# EAGLE design 35x35 (EAGLE 6.4)
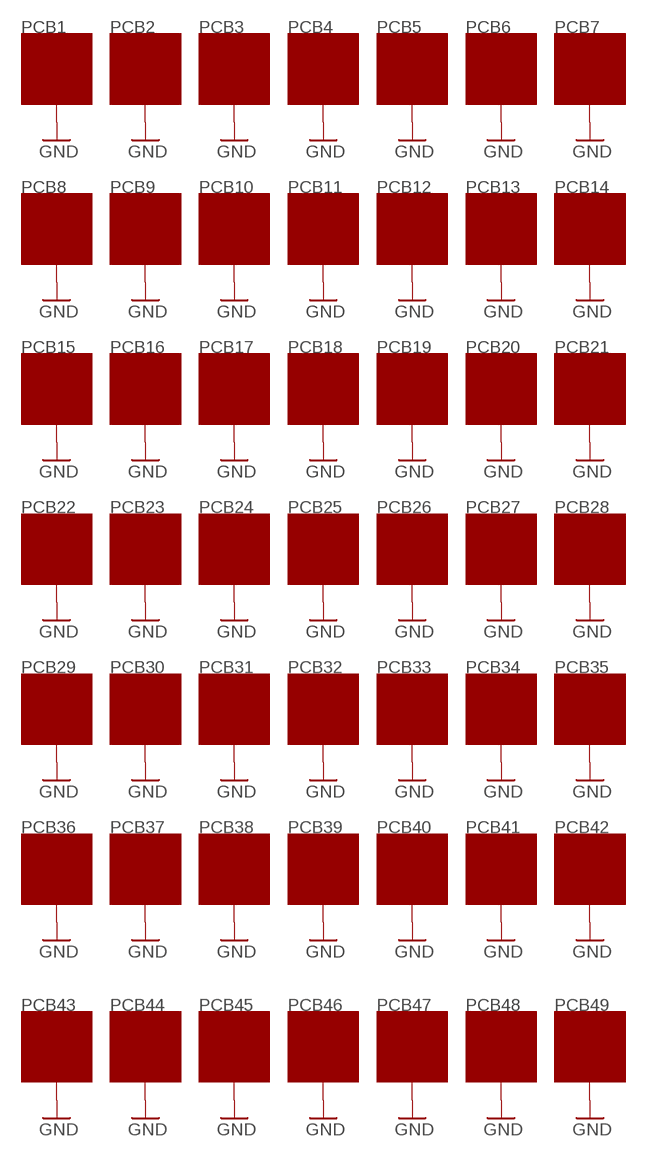
[diagram p0: schematic, sheet 1]

## Parts
PCB1  ZZZ_MODULE05X05  [ZZZ_MODULE_05X05]
PCB2  ZZZ_MODULE05X05  [ZZZ_MODULE_05X05]
PCB3  ZZZ_MODULE05X05  [ZZZ_MODULE_05X05]
PCB4  ZZZ_MODULE05X05  [ZZZ_MODULE_05X05]
PCB5  ZZZ_MODULE05X05  [ZZZ_MODULE_05X05]
PCB6  ZZZ_MODULE05X05  [ZZZ_MODULE_05X05]
PCB7  ZZZ_MODULE05X05  [ZZZ_MODULE_05X05]
PCB8  ZZZ_MODULE05X05  [ZZZ_MODULE_05X05]
PCB9  ZZZ_MODULE05X05  [ZZZ_MODULE_05X05]
PCB10  ZZZ_MODULE05X05  [ZZZ_MODULE_05X05]
PCB11  ZZZ_MODULE05X05  [ZZZ_MODULE_05X05]
PCB12  ZZZ_MODULE05X05  [ZZZ_MODULE_05X05]
PCB13  ZZZ_MODULE05X05  [ZZZ_MODULE_05X05]
PCB14  ZZZ_MODULE05X05  [ZZZ_MODULE_05X05]
PCB15  ZZZ_MODULE05X05  [ZZZ_MODULE_05X05]
PCB16  ZZZ_MODULE05X05  [ZZZ_MODULE_05X05]
PCB17  ZZZ_MODULE05X05  [ZZZ_MODULE_05X05]
PCB18  ZZZ_MODULE05X05  [ZZZ_MODULE_05X05]
PCB19  ZZZ_MODULE05X05  [ZZZ_MODULE_05X05]
PCB20  ZZZ_MODULE05X05  [ZZZ_MODULE_05X05]
PCB21  ZZZ_MODULE05X05  [ZZZ_MODULE_05X05]
PCB22  ZZZ_MODULE05X05  [ZZZ_MODULE_05X05]
PCB23  ZZZ_MODULE05X05  [ZZZ_MODULE_05X05]
PCB24  ZZZ_MODULE05X05  [ZZZ_MODULE_05X05]
PCB25  ZZZ_MODULE05X05  [ZZZ_MODULE_05X05]
PCB26  ZZZ_MODULE05X05  [ZZZ_MODULE_05X05]
PCB27  ZZZ_MODULE05X05  [ZZZ_MODULE_05X05]
PCB28  ZZZ_MODULE05X05  [ZZZ_MODULE_05X05]
PCB29  ZZZ_MODULE05X05  [ZZZ_MODULE_05X05]
PCB30  ZZZ_MODULE05X05  [ZZZ_MODULE_05X05]
PCB31  ZZZ_MODULE05X05  [ZZZ_MODULE_05X05]
PCB32  ZZZ_MODULE05X05  [ZZZ_MODULE_05X05]
PCB33  ZZZ_MODULE05X05  [ZZZ_MODULE_05X05]
PCB34  ZZZ_MODULE05X05  [ZZZ_MODULE_05X05]
PCB35  ZZZ_MODULE05X05  [ZZZ_MODULE_05X05]
PCB36  ZZZ_MODULE05X05  [ZZZ_MODULE_05X05]
PCB37  ZZZ_MODULE05X05  [ZZZ_MODULE_05X05]
PCB38  ZZZ_MODULE05X05  [ZZZ_MODULE_05X05]
PCB39  ZZZ_MODULE05X05  [ZZZ_MODULE_05X05]
PCB40  ZZZ_MODULE05X05  [ZZZ_MODULE_05X05]
PCB41  ZZZ_MODULE05X05  [ZZZ_MODULE_05X05]
PCB42  ZZZ_MODULE05X05  [ZZZ_MODULE_05X05]
PCB43  ZZZ_MODULE05X05  [ZZZ_MODULE_05X05]
PCB44  ZZZ_MODULE05X05  [ZZZ_MODULE_05X05]
PCB45  ZZZ_MODULE05X05  [ZZZ_MODULE_05X05]
PCB46  ZZZ_MODULE05X05  [ZZZ_MODULE_05X05]
PCB47  ZZZ_MODULE05X05  [ZZZ_MODULE_05X05]
PCB48  ZZZ_MODULE05X05  [ZZZ_MODULE_05X05]
PCB49  ZZZ_MODULE05X05  [ZZZ_MODULE_05X05]

## Nets
GND: PCB1.GND@1(GND) PCB1.GND@2(GND) PCB1.GND@3(GND) PCB1.GND@4(GND) PCB1.GND@5(GND) PCB1.GND@6(GND) PCB1.GND@7(GND) PCB1.GND@8(GND) PCB2.GND@1(GND) PCB2.GND@2(GND) PCB2.GND@3(GND) PCB2.GND@4(GND) PCB2.GND@5(GND) PCB2.GND@6(GND) PCB2.GND@7(GND) PCB2.GND@8(GND) PCB3.GND@1(GND) PCB3.GND@2(GND) PCB3.GND@3(GND) PCB3.GND@4(GND) PCB3.GND@5(GND) PCB3.GND@6(GND) PCB3.GND@7(GND) PCB3.GND@8(GND) PCB4.GND@1(GND) PCB4.GND@2(GND) PCB4.GND@3(GND) PCB4.GND@4(GND) PCB4.GND@5(GND) PCB4.GND@6(GND) PCB4.GND@7(GND) PCB4.GND@8(GND) PCB5.GND@1(GND) PCB5.GND@2(GND) PCB5.GND@3(GND) PCB5.GND@4(GND) PCB5.GND@5(GND) PCB5.GND@6(GND) PCB5.GND@7(GND) PCB5.GND@8(GND) PCB6.GND@1(GND) PCB6.GND@2(GND) PCB6.GND@3(GND) PCB6.GND@4(GND) PCB6.GND@5(GND) PCB6.GND@6(GND) PCB6.GND@7(GND) PCB6.GND@8(GND) PCB7.GND@1(GND) PCB7.GND@2(GND) PCB7.GND@3(GND) PCB7.GND@4(GND) PCB7.GND@5(GND) PCB7.GND@6(GND) PCB7.GND@7(GND) PCB7.GND@8(GND) PCB8.GND@1(GND) PCB8.GND@2(GND) PCB8.GND@3(GND) PCB8.GND@4(GND) PCB8.GND@5(GND) PCB8.GND@6(GND) PCB8.GND@7(GND) PCB8.GND@8(GND) PCB9.GND@1(GND) PCB9.GND@2(GND) PCB9.GND@3(GND) PCB9.GND@4(GND) PCB9.GND@5(GND) PCB9.GND@6(GND) PCB9.GND@7(GND) PCB9.GND@8(GND) PCB10.GND@1(GND) PCB10.GND@2(GND) PCB10.GND@3(GND) PCB10.GND@4(GND) PCB10.GND@5(GND) PCB10.GND@6(GND) PCB10.GND@7(GND) PCB10.GND@8(GND) PCB11.GND@1(GND) PCB11.GND@2(GND) PCB11.GND@3(GND) PCB11.GND@4(GND) PCB11.GND@5(GND) PCB11.GND@6(GND) PCB11.GND@7(GND) PCB11.GND@8(GND) PCB12.GND@1(GND) PCB12.GND@2(GND) PCB12.GND@3(GND) PCB12.GND@4(GND) PCB12.GND@5(GND) PCB12.GND@6(GND) PCB12.GND@7(GND) PCB12.GND@8(GND) PCB13.GND@1(GND) PCB13.GND@2(GND) PCB13.GND@3(GND) PCB13.GND@4(GND) PCB13.GND@5(GND) PCB13.GND@6(GND) PCB13.GND@7(GND) PCB13.GND@8(GND) PCB14.GND@1(GND) PCB14.GND@2(GND) PCB14.GND@3(GND) PCB14.GND@4(GND) PCB14.GND@5(GND) PCB14.GND@6(GND) PCB14.GND@7(GND) PCB14.GND@8(GND) PCB15.GND@1(GND) PCB15.GND@2(GND) PCB15.GND@3(GND) PCB15.GND@4(GND) PCB15.GND@5(GND) PCB15.GND@6(GND) PCB15.GND@7(GND) PCB15.GND@8(GND) PCB16.GND@1(GND) PCB16.GND@2(GND) PCB16.GND@3(GND) PCB16.GND@4(GND) PCB16.GND@5(GND) PCB16.GND@6(GND) PCB16.GND@7(GND) PCB16.GND@8(GND) PCB17.GND@1(GND) PCB17.GND@2(GND) PCB17.GND@3(GND) PCB17.GND@4(GND) PCB17.GND@5(GND) PCB17.GND@6(GND) PCB17.GND@7(GND) PCB17.GND@8(GND) PCB18.GND@1(GND) PCB18.GND@2(GND) PCB18.GND@3(GND) PCB18.GND@4(GND) PCB18.GND@5(GND) PCB18.GND@6(GND) PCB18.GND@7(GND) PCB18.GND@8(GND) PCB19.GND@1(GND) PCB19.GND@2(GND) PCB19.GND@3(GND) PCB19.GND@4(GND) PCB19.GND@5(GND) PCB19.GND@6(GND) PCB19.GND@7(GND) PCB19.GND@8(GND) PCB20.GND@1(GND) PCB20.GND@2(GND) PCB20.GND@3(GND) PCB20.GND@4(GND) PCB20.GND@5(GND) PCB20.GND@6(GND) PCB20.GND@7(GND) PCB20.GND@8(GND) PCB21.GND@1(GND) PCB21.GND@2(GND) PCB21.GND@3(GND) PCB21.GND@4(GND) PCB21.GND@5(GND) PCB21.GND@6(GND) PCB21.GND@7(GND) PCB21.GND@8(GND) PCB22.GND@1(GND) PCB22.GND@2(GND) PCB22.GND@3(GND) PCB22.GND@4(GND) PCB22.GND@5(GND) PCB22.GND@6(GND) PCB22.GND@7(GND) PCB22.GND@8(GND) PCB23.GND@1(GND) PCB23.GND@2(GND) PCB23.GND@3(GND) PCB23.GND@4(GND) PCB23.GND@5(GND) PCB23.GND@6(GND) PCB23.GND@7(GND) PCB23.GND@8(GND) PCB24.GND@1(GND) PCB24.GND@2(GND) PCB24.GND@3(GND) PCB24.GND@4(GND) PCB24.GND@5(GND) PCB24.GND@6(GND) PCB24.GND@7(GND) PCB24.GND@8(GND) PCB25.GND@1(GND) PCB25.GND@2(GND) PCB25.GND@3(GND) PCB25.GND@4(GND) PCB25.GND@5(GND) PCB25.GND@6(GND) PCB25.GND@7(GND) PCB25.GND@8(GND) PCB26.GND@1(GND) PCB26.GND@2(GND) PCB26.GND@3(GND) PCB26.GND@4(GND) PCB26.GND@5(GND) PCB26.GND@6(GND) PCB26.GND@7(GND) PCB26.GND@8(GND) PCB27.GND@1(GND) PCB27.GND@2(GND) PCB27.GND@3(GND) PCB27.GND@4(GND) PCB27.GND@5(GND) PCB27.GND@6(GND) PCB27.GND@7(GND) PCB27.GND@8(GND) PCB28.GND@1(GND) PCB28.GND@2(GND) PCB28.GND@3(GND) PCB28.GND@4(GND) PCB28.GND@5(GND) PCB28.GND@6(GND) PCB28.GND@7(GND) PCB28.GND@8(GND) PCB29.GND@1(GND) PCB29.GND@2(GND) PCB29.GND@3(GND) PCB29.GND@4(GND) PCB29.GND@5(GND) PCB29.GND@6(GND) PCB29.GND@7(GND) PCB29.GND@8(GND) PCB30.GND@1(GND) PCB30.GND@2(GND) PCB30.GND@3(GND) PCB30.GND@4(GND) PCB30.GND@5(GND) PCB30.GND@6(GND) PCB30.GND@7(GND) PCB30.GND@8(GND) PCB31.GND@1(GND) PCB31.GND@2(GND) PCB31.GND@3(GND) PCB31.GND@4(GND) PCB31.GND@5(GND) PCB31.GND@6(GND) PCB31.GND@7(GND) PCB31.GND@8(GND) PCB32.GND@1(GND) PCB32.GND@2(GND) PCB32.GND@3(GND) PCB32.GND@4(GND) PCB32.GND@5(GND) PCB32.GND@6(GND) PCB32.GND@7(GND) PCB32.GND@8(GND) PCB33.GND@1(GND) PCB33.GND@2(GND) PCB33.GND@3(GND) PCB33.GND@4(GND) PCB33.GND@5(GND) PCB33.GND@6(GND) PCB33.GND@7(GND) PCB33.GND@8(GND) PCB34.GND@1(GND) PCB34.GND@2(GND) PCB34.GND@3(GND) PCB34.GND@4(GND) PCB34.GND@5(GND) PCB34.GND@6(GND) PCB34.GND@7(GND) PCB34.GND@8(GND) PCB35.GND@1(GND) PCB35.GND@2(GND) PCB35.GND@3(GND) PCB35.GND@4(GND) PCB35.GND@5(GND) PCB35.GND@6(GND) PCB35.GND@7(GND) PCB35.GND@8(GND) PCB36.GND@1(GND) PCB36.GND@2(GND) PCB36.GND@3(GND) PCB36.GND@4(GND) PCB36.GND@5(GND) PCB36.GND@6(GND) PCB36.GND@7(GND) PCB36.GND@8(GND) PCB37.GND@1(GND) PCB37.GND@2(GND) PCB37.GND@3(GND) PCB37.GND@4(GND) PCB37.GND@5(GND) PCB37.GND@6(GND) PCB37.GND@7(GND) PCB37.GND@8(GND) PCB38.GND@1(GND) PCB38.GND@2(GND) PCB38.GND@3(GND) PCB38.GND@4(GND) PCB38.GND@5(GND) PCB38.GND@6(GND) PCB38.GND@7(GND) PCB38.GND@8(GND) PCB39.GND@1(GND) PCB39.GND@2(GND) PCB39.GND@3(GND) PCB39.GND@4(GND) PCB39.GND@5(GND) PCB39.GND@6(GND) PCB39.GND@7(GND) PCB39.GND@8(GND) PCB40.GND@1(GND) PCB40.GND@2(GND) PCB40.GND@3(GND) PCB40.GND@4(GND) PCB40.GND@5(GND) PCB40.GND@6(GND) PCB40.GND@7(GND) PCB40.GND@8(GND) PCB41.GND@1(GND) PCB41.GND@2(GND) PCB41.GND@3(GND) PCB41.GND@4(GND) PCB41.GND@5(GND) PCB41.GND@6(GND) PCB41.GND@7(GND) PCB41.GND@8(GND) PCB42.GND@1(GND) PCB42.GND@2(GND) PCB42.GND@3(GND) PCB42.GND@4(GND) PCB42.GND@5(GND) PCB42.GND@6(GND) PCB42.GND@7(GND) PCB42.GND@8(GND) PCB43.GND@1(GND) PCB43.GND@2(GND) PCB43.GND@3(GND) PCB43.GND@4(GND) PCB43.GND@5(GND) PCB43.GND@6(GND) PCB43.GND@7(GND) PCB43.GND@8(GND) PCB44.GND@1(GND) PCB44.GND@2(GND) PCB44.GND@3(GND) PCB44.GND@4(GND) PCB44.GND@5(GND) PCB44.GND@6(GND) PCB44.GND@7(GND) PCB44.GND@8(GND) PCB45.GND@1(GND) PCB45.GND@2(GND) PCB45.GND@3(GND) PCB45.GND@4(GND) PCB45.GND@5(GND) PCB45.GND@6(GND) PCB45.GND@7(GND) PCB45.GND@8(GND) PCB46.GND@1(GND) PCB46.GND@2(GND) PCB46.GND@3(GND) PCB46.GND@4(GND) PCB46.GND@5(GND) PCB46.GND@6(GND) PCB46.GND@7(GND) PCB46.GND@8(GND) PCB47.GND@1(GND) PCB47.GND@2(GND) PCB47.GND@3(GND) PCB47.GND@4(GND) PCB47.GND@5(GND) PCB47.GND@6(GND) PCB47.GND@7(GND) PCB47.GND@8(GND) PCB48.GND@1(GND) PCB48.GND@2(GND) PCB48.GND@3(GND) PCB48.GND@4(GND) PCB48.GND@5(GND) PCB48.GND@6(GND) PCB48.GND@7(GND) PCB48.GND@8(GND) PCB49.GND@1(GND) PCB49.GND@2(GND) PCB49.GND@3(GND) PCB49.GND@4(GND) PCB49.GND@5(GND) PCB49.GND@6(GND) PCB49.GND@7(GND) PCB49.GND@8(GND)

## Library data of the parts
PCB1-PCB49 = GNLib:ZZZ_MODULE

## Board
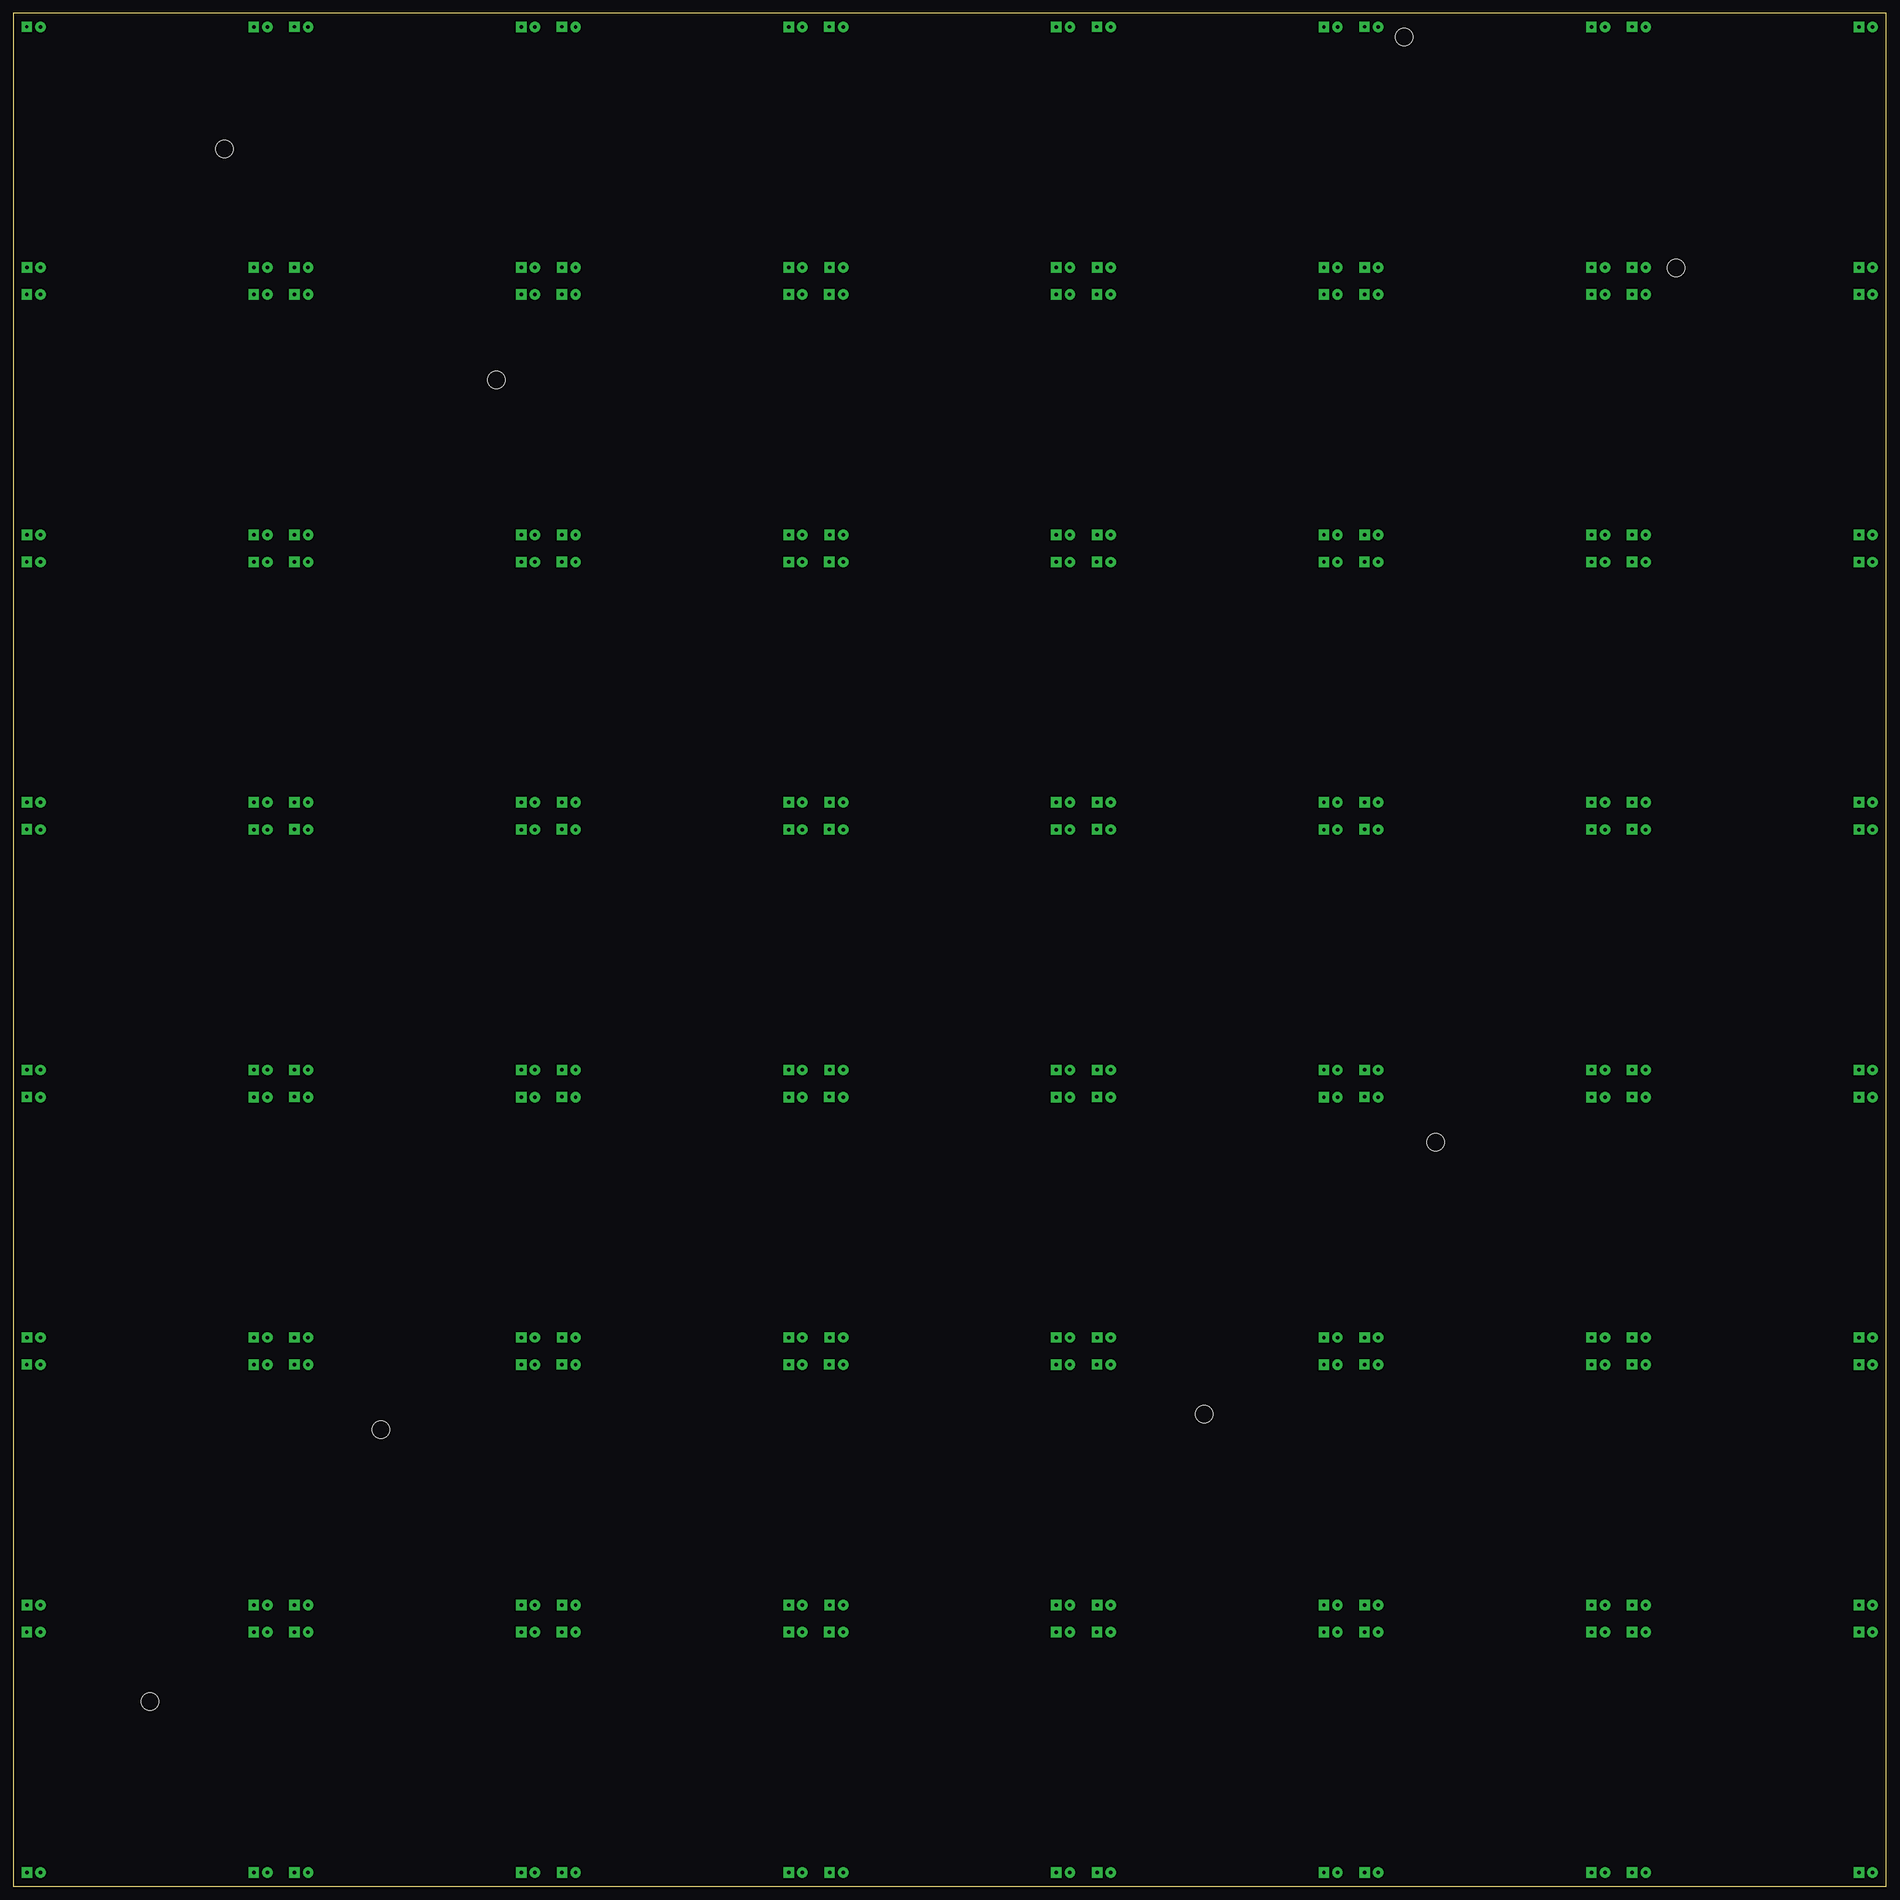
[diagram p1: board, top side]
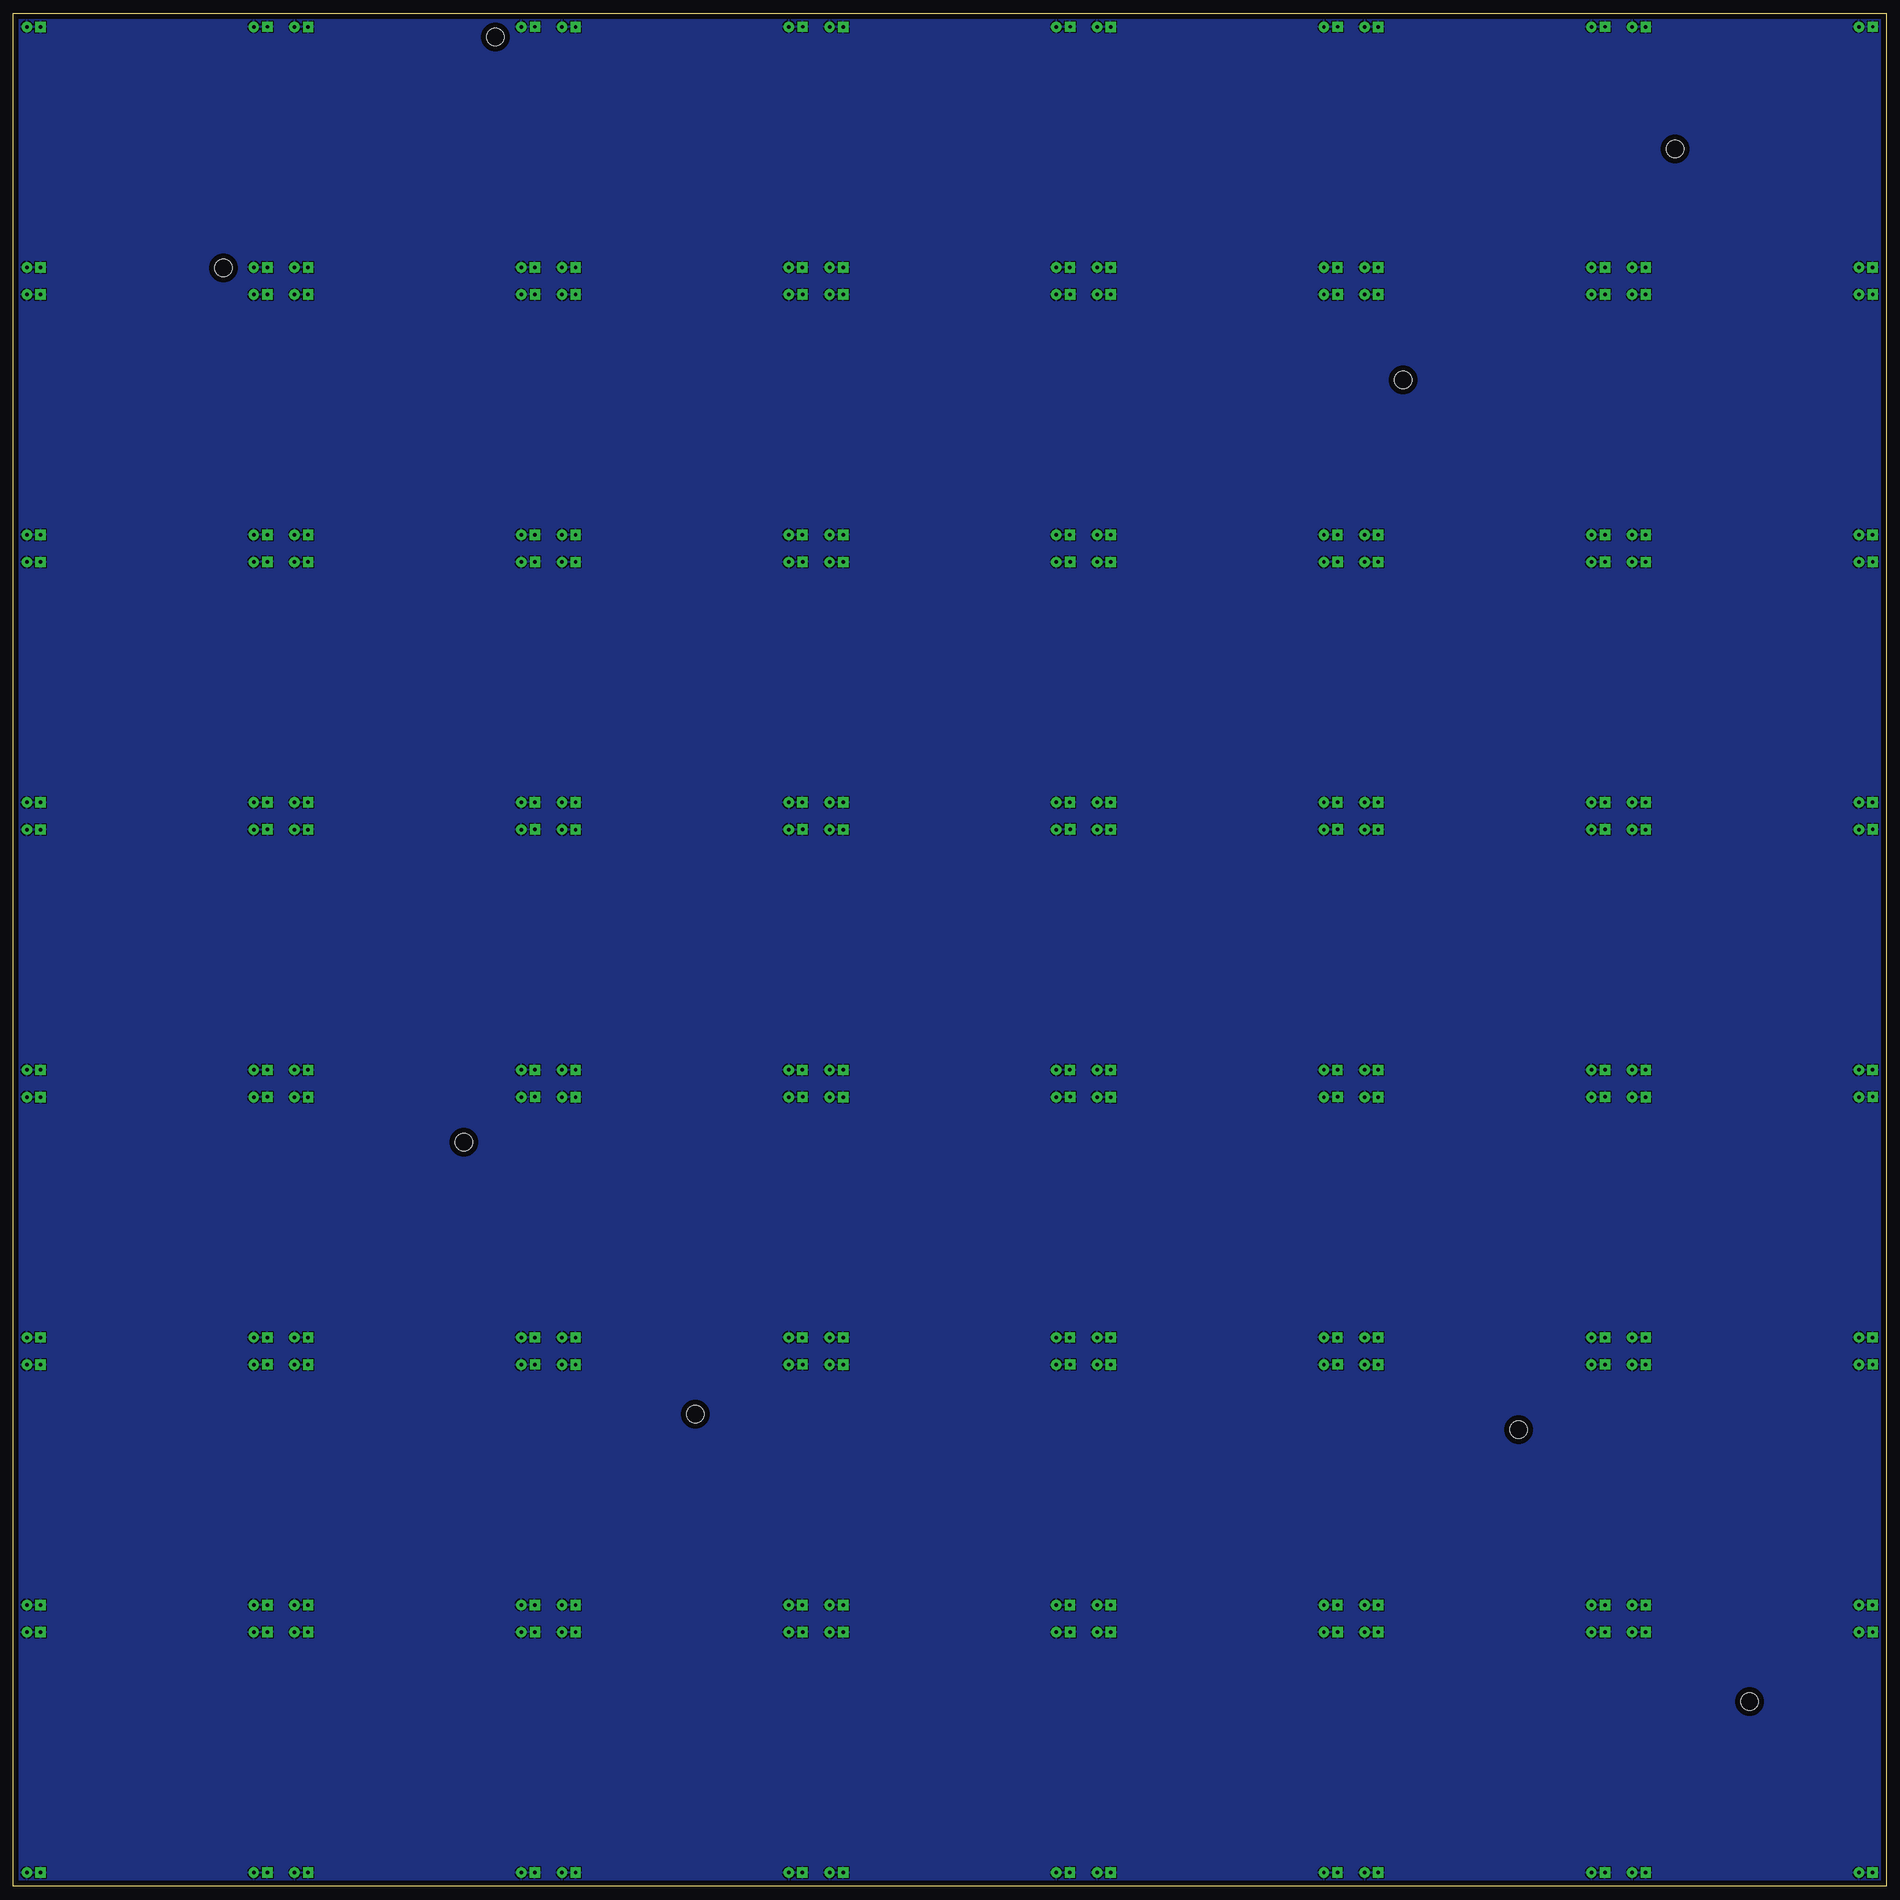
[diagram p2: board, bottom side, seen from below]

Size 350 x 350 mm. Coordinates in mm from the lower left corner, seen from the top.
Outline: 0,0 350,0 350,350 0,350 0,0
Copper layers (1*16): Top 0.035mm / dielectric 1.5mm / Bottom 0.035mm
Design rules "default": minimum track width 10mil, minimum drill 24mil, track to track 8mil, track to pad 8mil, pad to pad 8mil, via to via 8mil, smd to smd 8mil, copper to edge 40mil, drill to drill 8mil, minimum pad ring 10mil, minimum via ring 8mil, stop-mask expansion 4mil, vias tented up to drill 0mil, thermal gap 10mil
Holes 3.3 mm at 259.94,345.61 310.73,302.42 39.47,324.65 90.26,281.47 25.49,34.51 68.67,85.31 222.59,88.23 265.78,139.03
tRestrict: area 258,343.7 to 261.8,347.5; area 308.8,300.5 to 312.6,304.3; area 37.6,322.7 to 41.4,326.6; area 88.4,279.6 to 92.2,283.4; area 23.6,32.6 to 27.4,36.4; area 66.8,83.4 to 70.6,87.2; area 220.7,86.3 to 224.5,90.1; area 263.9,137.1 to 267.7,140.9
bRestrict: area 258,343.7 to 261.8,347.5; area 308.8,300.5 to 312.6,304.3; area 37.6,322.7 to 41.4,326.6; area 88.4,279.6 to 92.2,283.4; area 23.6,32.6 to 27.4,36.4; area 66.8,83.4 to 70.6,87.2; area 220.7,86.3 to 224.5,90.1; area 263.9,137.1 to 267.7,140.9

### Footprints (pad centres in the part's own frame; a part is rotated, then mirrored left to right if it is on the bottom)
ZZZ_MODULE_05X05 = drill 0.64 pad 1.93 square: GND@1 2.5,47.5; GND@2 44.92,47.46; GND@7 2.54,2.54; GND@8 44.92,2.54 | drill 0.64 pad 1.93: GND@3 47.46,47.46; GND@4 5.08,47.46; GND@5 47.46,2.54; GND@6 5.08,2.54

### Placement (x,y rotation side)
PCB1  0,300 0 top
PCB2  50,300 0 top
PCB3  100,300 0 top
PCB4  150,300 0 top
PCB5  200,300 0 top
PCB6  250,300 0 top
PCB7  300,300 0 top
PCB8  0,250 0 top
PCB9  50,250 0 top
PCB10  100,250 0 top
PCB11  150,250 0 top
PCB12  200,250 0 top
PCB13  250,250 0 top
PCB14  300,250 0 top
PCB15  0,200 0 top
PCB16  50,200 0 top
PCB17  100,200 0 top
PCB18  150,200 0 top
PCB19  200,200 0 top
PCB20  250,200 0 top
PCB21  300,200 0 top
PCB22  0,150 0 top
PCB23  50,150 0 top
PCB24  100,150 0 top
PCB25  150,150 0 top
PCB26  200,150 0 top
PCB27  250,150 0 top
PCB28  300,150 0 top
PCB29  0,100 0 top
PCB30  50,100 0 top
PCB31  100,100 0 top
PCB32  150,100 0 top
PCB33  200,100 0 top
PCB34  250,100 0 top
PCB35  300,100 0 top
PCB36  0,50 0 top
PCB37  50,50 0 top
PCB38  100,50 0 top
PCB39  150,50 0 top
PCB40  200,50 0 top
PCB41  250,50 0 top
PCB42  300,50 0 top
PCB43  0,0 0 top
PCB44  50,0 0 top
PCB45  100,0 0 top
PCB46  150,0 0 top
PCB47  200,0 0 top
PCB48  250,0 0 top
PCB49  300,0 0 top

### Tracks (layer width: path | path; a pad name or v marks a point on that pad's centre or on a via)
GND
  pour Bottom: 0,0 350,0 350,350 0,350

### Text on the board
bRestrict: 01 | 02 | 03 | 04 | 05 | 06 | 07 | 08 | 09 | 10 | 11 | 12 | 13 | 14 | 15 | 16 | 17 | 18 | 19 | 20 | 21 | 22 | 23 | 24 | 25 | 26 | 27 | 28 | 29 | 30 | 31 | 32 | 33 | 34 | 35 | 36 | 37 | 38 | 39 | 40 | 41 | 42 | 43 | 44 | 45 | 46 | 47 | 48 | 49